# EAGLE design leds (EAGLE 6.4)
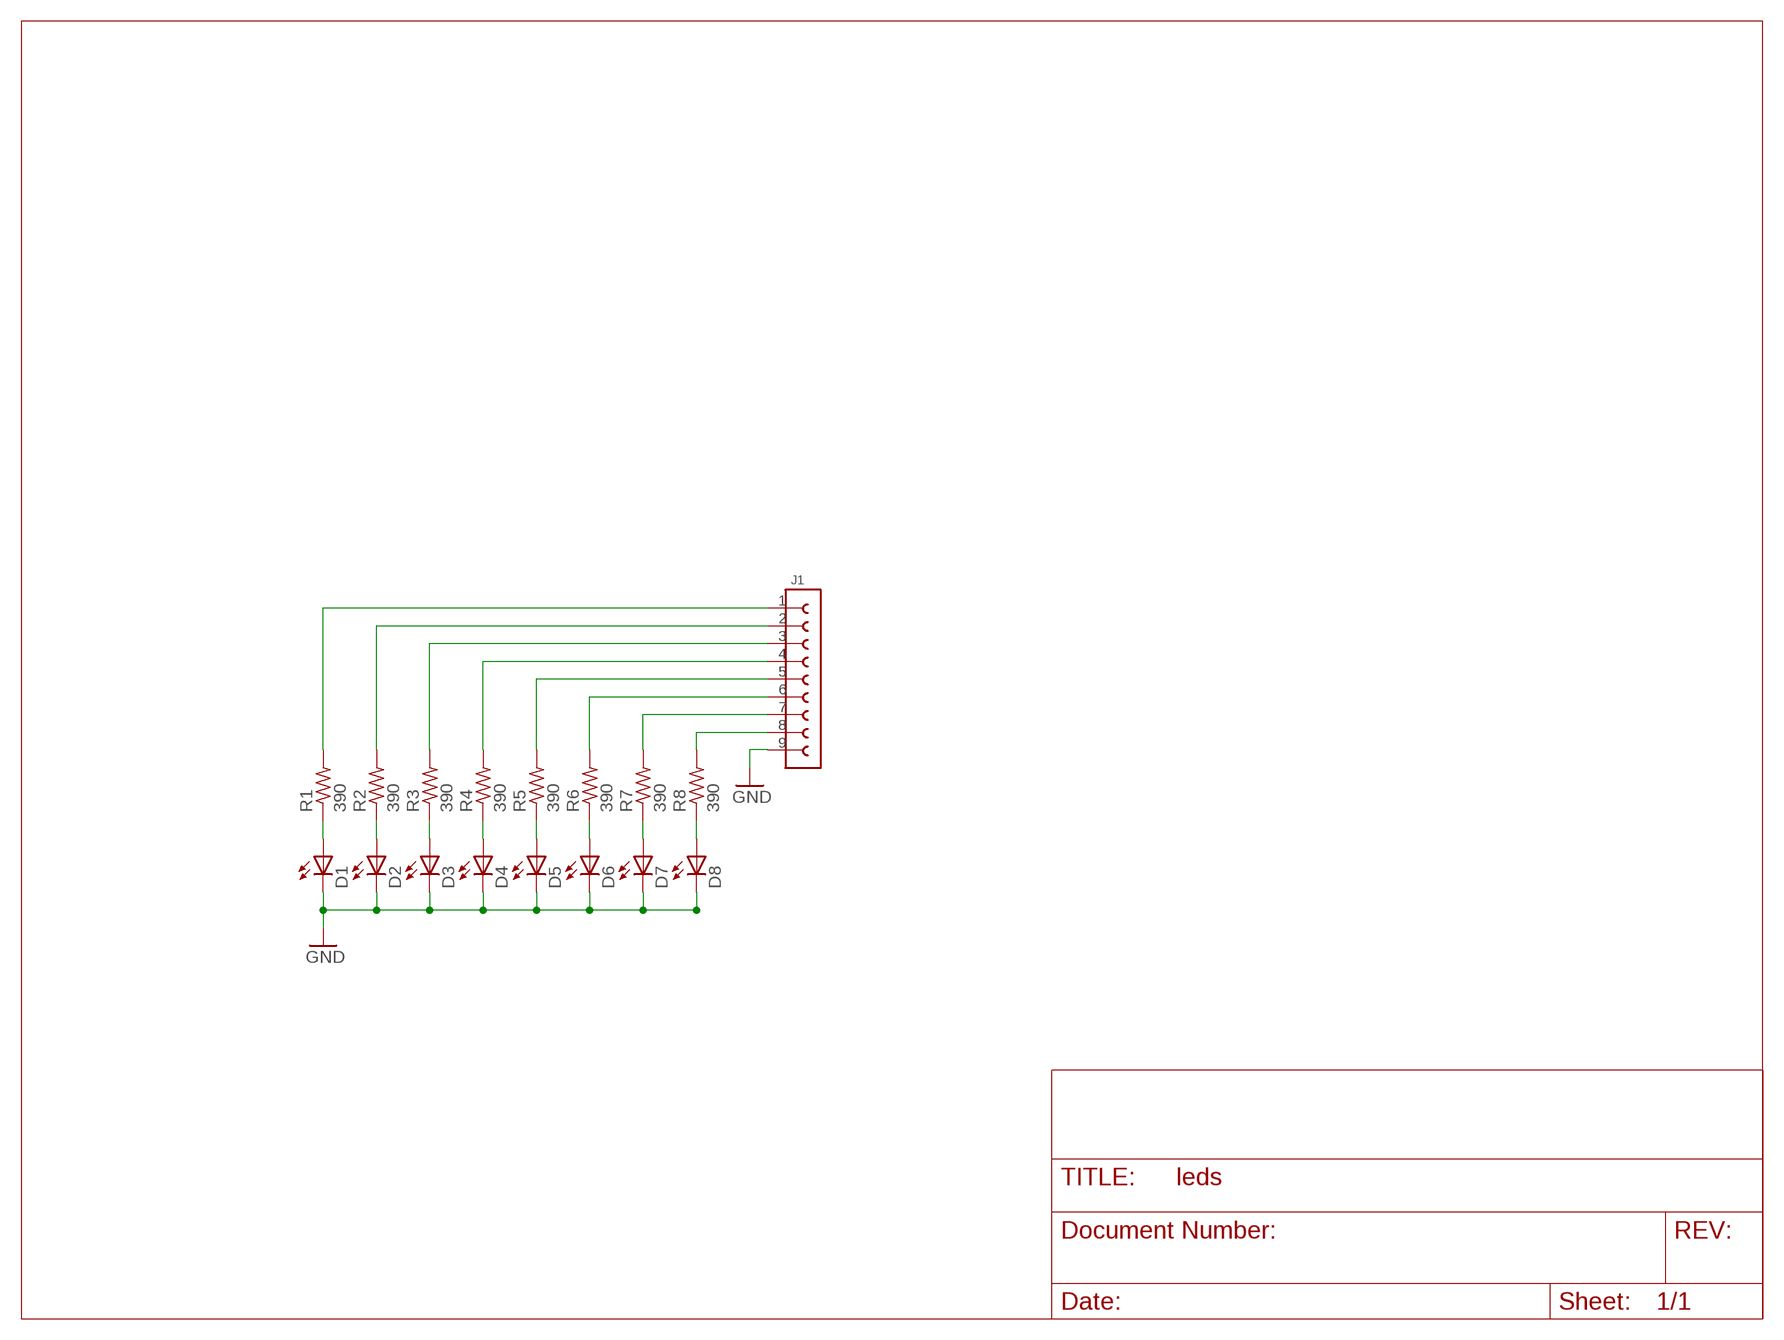
[diagram p0: schematic, sheet 1]

## Parts
D1  SM0805AC  [D0805]
D2  SM0805AC  [D0805]
D3  SM0805AC  [D0805]
D4  SM0805AC  [D0805]
D5  SM0805AC  [D0805]
D6  SM0805AC  [D0805]
D7  SM0805AC  [D0805]
D8  SM0805AC  [D0805]
J1  61300911121  [PHSP254P2286X254X1154-9S]
R1  390  CRG0603F390R  [RESC0603]
R2  390  CRG0603F390R  [RESC0603]
R3  390  CRG0603F390R  [RESC0603]
R4  390  CRG0603F390R  [RESC0603]
R5  390  CRG0603F390R  [RESC0603]
R6  390  CRG0603F390R  [RESC0603]
R7  390  CRG0603F390R  [RESC0603]
R8  390  CRG0603F390R  [RESC0603]

## Nets
GND: D1.2(C) D2.2(C) D3.2(C) D4.2(C) D5.2(C) D6.2(C) D7.2(C) D8.2(C) J1.9
N$1: D1.1(A) R1.P$1
N$2: D2.1(A) R2.P$1
N$3: D3.1(A) R3.P$1
N$4: D4.1(A) R4.P$1
N$5: D5.1(A) R5.P$1
N$6: D6.1(A) R6.P$1
N$7: D7.1(A) R7.P$1
N$8: D8.1(A) R8.P$1
N$10: J1.8 R8.P$2
N$11: J1.7 R7.P$2
N$12: J1.6 R6.P$2
N$13: J1.5 R5.P$2
N$14: J1.4 R4.P$2
N$15: J1.3 R3.P$2
N$16: J1.2 R2.P$2
N$17: J1.1 R1.P$2

## Library data of the parts
D1-D8 = bivar-smleds:SM0805*: Surface Mount LED 0805 Description Bivar Surface Mount 0805 package LED may be used in nearly any lighting or indication application. The miniature package is ideal for small scale applications such as general indication and backlighting. Low power consumption and excellent long life reliability are suitable for battery powered equipment. Bivar offers water clear LED lens for maximum luminous intensity. Wide variety of wavelength and intensity combinations are available to meet any illumination need. The SM0805 LED is packaged in standard tape and reels for pick and place assemblies. ♦ Industry Standard 0805 Package ♦ RoHS Compliant ♦ Small Package and Footprint ♦ Water Clear Lens ♦ Wide Viewing Angle ♦ Ideal for Status Indication, Display, and Backlighting How to Order Type Package Color Clear type Current level SM = Surface mount 0805 A = Amber BW = Blue G = Green H = HE red O = Orange PG = Pure Green R = Read SB = Super Blue SG = Super Green SPG = Super Pure Green SR = Super Red UBW = Ultra Blue UH = Ultra HE Red UO = Ultra Orange UPG = Ultra Pure Green UR = Ultra Red UW = Ultra White UY = Ultra Yellow XPG = Xtra Pure Green Y = Yellow C = Water Clear None = standart L = Low Current Ref: Link <http://www.bivar.com/Products/LEDIndication/LEDs/SurfaceMountLEDs.aspx> Add more variants to SM0805@, just remplace the "@" with a new technologie named according to order code parameters. It is mandatory to fill up the following attributes DESCRIPTION, MOUSER, AVNET, ARROW, FUTURE, NEWARK, DIGIKEY, AVRG-PRICE, OCTOPART-LINK, DATASHEET; AVRG-PRICE: 0.4; DATASHEET: http://www.bivar.com/Images/Cart/SM0805AC.pdf; DESCRIPTION: LED, SMD, 0805, 2 Leads, Amber, Water Clear Lens, 130 Deg Viewing Angle; DIGIKEY: SM0805AC-ND; EAGLEUP: D0805; MOUSER: 749-SM0805AC; NEWARK: 20K3100; OCTOPART-LINK: http://octopart.com/sm0805ac-bivar-5838577
J1 = wurth-pin-socket-headers:6130091?: (9) 2.54mm Pin Header Description MATERIAL INSULATOR: PBT FLAMABILITY RATING: UL94-V0 COLOR: BLACK CONTACT MATERIAL: COPPER ALLOY CONTACT TYPE: STAMPED CONTACT PLATING: GOLD QUALITY CLASS: 3 AS PER CECC 75 301-802 PITCH: 2.54MM ENVIRONMENTAL OPERATING TEMPERATURE: -40 UP TO 125°C COMPLIANCE: LEAD FREE AND ROHS ELECTRICAL CURRENT RATING: 3A WORKING VOLTAGE: 250V AC INSULATOR RESISTANCE: >1000 MOHM DIELECTRIC WITHSTANDING VOLTAGE: 500V AC/MN CONTACT RESISTANCE: 20 mOHM MAX DIMENSION B = 2.54 x NB POSITIONS How to order Type Header/Socket Number of Positions Variation 613 = 2.54mm Pitch from 1 to 40 1121 = Pin Header Straigh Post 1021 = Pin Header Right Angle 1821 = Socket Header Straigh Post 43121 = Socket Header Right Angle Ref: Datasheet <http://katalog.we-online.de/em/datasheet/6130xx11121.pdf> , Datasheet <http://katalog.we-online.de/em/datasheet/6130xx11021.pdf> , Datasheet <http://katalog.we-online.de/em/datasheet/6130xx11821.pdf> , Datasheet <http://katalog.we-online.de/em/datasheet/6130xx143121.pdf>
R1-R8 = te-fixed-resistors:CRG?*: Thick Film Chip Resistors 1% and 5% tolerance Description Precious metal terminations are screen printed onto a ceramic base and fired. The resistive element is screen printed and fired and the passivation layer added. Each resistor is trimmed to tolerance by laser. The pre-scribed tile is broken into strips, the end plating is fired on and the strips broken into individual components. Final termination is made by electroplating. Key Features Thick film resistors with a high power to size ratio,ideally suited to industrial and general purpose use. A range from 1 ohm to 10M and tolerances of 1% and 5%. Also including zero ohm links. Suitable for most applications, including high frequency operation, owing to the short lead structure and low capacitance. Seven Package Sizes Terminal finish: Matte Sn MSL Level 2 How to order Common Part Size Tolerance Resistance Value CRG - Thick Film Chip Resistor 0201 0402 0603 0805 1206 2512 F - ±1% J - ±5% 1 ohm (1 ohm) 1R0 1K ohm (1000 ohms) 1K 100K ohm (100000 ohms) 100K 1M ohm (1000000 ohms) 1M Ref: Datasheet <http://www.te.com/commerce/DocumentDelivery/DDEController?Action=showdoc&DocId=Data+Sheet%7F1773204%7FH%7Fpdf%7FEnglish%7FENG_DS_1773204_H.pdf%7F1623095-1>; AVRG-PRICE: 0.1; DATASHEET: http://www.te.com/commerce/DocumentDelivery/DDEController?Action=showdoc&DocId=Data+Sheet%7F1773204%7FH%7Fpdf%7FEnglish%7FENG_DS_1773204_H.pdf%7F1623095-1; DESCRIPTION: Resistores de película gruesa - SMD 0603 390Ohms 1/10W 50V; EAGLEUP: RESC0603; MOUSER: 279-CRG0603F390R; OCTOPART-LINK: http://octopart.com/crg0603f390r-tyco+electronics-16077369

## Board
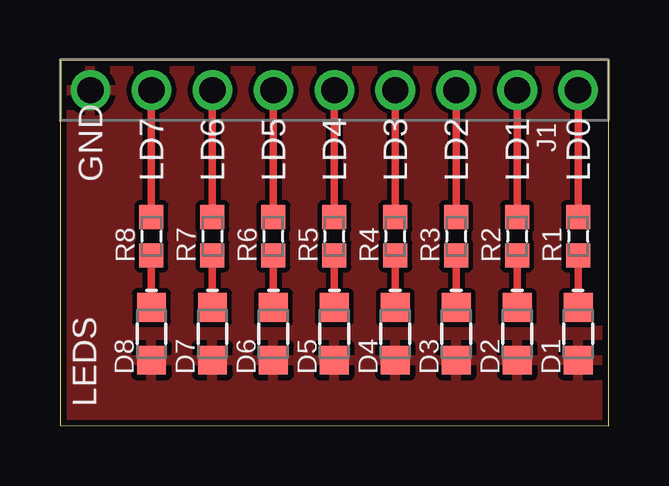
[diagram p1: board, top side]
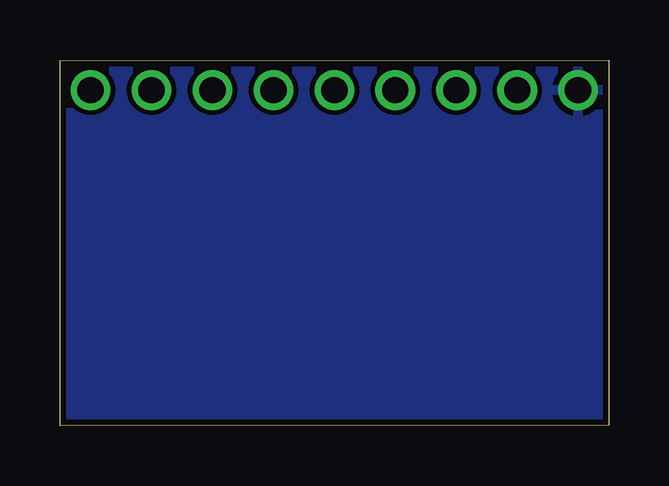
[diagram p2: board, bottom side, seen from below]

Size 22.86 x 15.26 mm. Coordinates in mm from the lower left corner, seen from the top.
Outline: 0,0.03 22.86,0 22.86,15.23 0,15.26 0,0.03
Copper layers (1*16): Top 0.035mm / dielectric 1.5mm / Bottom 0.035mm
Design rules "default *": minimum track width 10mil, minimum drill 24mil, track to track 8mil, track to pad 8mil, pad to pad 8mil, via to via 8mil, smd to smd 8mil, copper to edge 10mil, drill to drill 8mil, minimum pad ring 10mil, minimum via ring 8mil, stop-mask expansion 4mil, vias tented up to drill 0mil, thermal gap 10mil

### Footprints (pad centres in the part's own frame; a part is rotated, then mirrored left to right if it is on the bottom)
D0805 = smd 1.2 x 1.2: 1 1.1,0; 2 -1.1,0
PHSP254P2286X254X1154-9S = drill 1.1: 1 0,0; 2 2.54,0; 3 5.08,0; 4 7.62,0; 5 10.16,0; 6 12.7,0; 7 15.24,0; 8 17.78,0; 9 20.32,0
RESC0603 = smd 1 x 1: P$1 0.8,0; P$2 -0.8,0

### Placement (x,y rotation side)
D1  21.59,3.84 90 top
D2  19.05,3.84 90 top
D3  16.51,3.84 90 top
D4  13.97,3.84 90 top
D5  11.43,3.84 90 top
D6  8.89,3.84 90 top
D7  6.35,3.84 90 top
D8  3.81,3.84 90 top
J1  21.59,14 180 top
R1  21.59,7.9 270 top
R2  19.05,7.9 270 top
R3  16.51,7.9 270 top
R4  13.97,7.9 270 top
R5  11.43,7.9 270 top
R6  8.89,7.9 270 top
R7  6.35,7.9 270 top
R8  3.81,7.9 270 top

### Tracks (layer width: path | path; a pad name or v marks a point on that pad's centre or on a via)
GND
  pour Top: 0,15.27 22.86,15.27 22.86,0.03 0,0.03
  pour Bottom: 0,15.27 22.86,15.27 22.86,0.03 0,0.03
N$1
  Top 0.305: R1.P$1 D1.1
N$2
  Top 0.305: R2.P$1 D2.1
N$3
  Top 0.305: R3.P$1 D3.1
N$4
  Top 0.305: R4.P$1 D4.1
N$5
  Top 0.305: R5.P$1 D5.1
N$6
  Top 0.305: R6.P$1 D6.1
N$7
  Top 0.305: R7.P$1 D7.1
N$8
  Top 0.305: D8.1 R8.P$1
N$10
  Top 0.305: R8.P$2 J1.8
N$11
  Top 0.305: J1.7 R7.P$2
N$12
  Top 0.305: J1.6 R6.P$2
N$13
  Top 0.305: J1.5 R5.P$2
N$14
  Top 0.305: J1.4 R4.P$2
N$15
  Top 0.305: J1.3 R3.P$2
N$16
  Top 0.305: J1.2 R2.P$2
N$17
  Top 0.305: J1.1 R1.P$2

### Text on the board
tPlace: GND | LD7 | LD6 | LD5 | LD4 | LD3 | LD2 | LD1 | LD0 | LEDS